# EAGLE schematic PCB 2.2.2 (EAGLE 6.5.0)
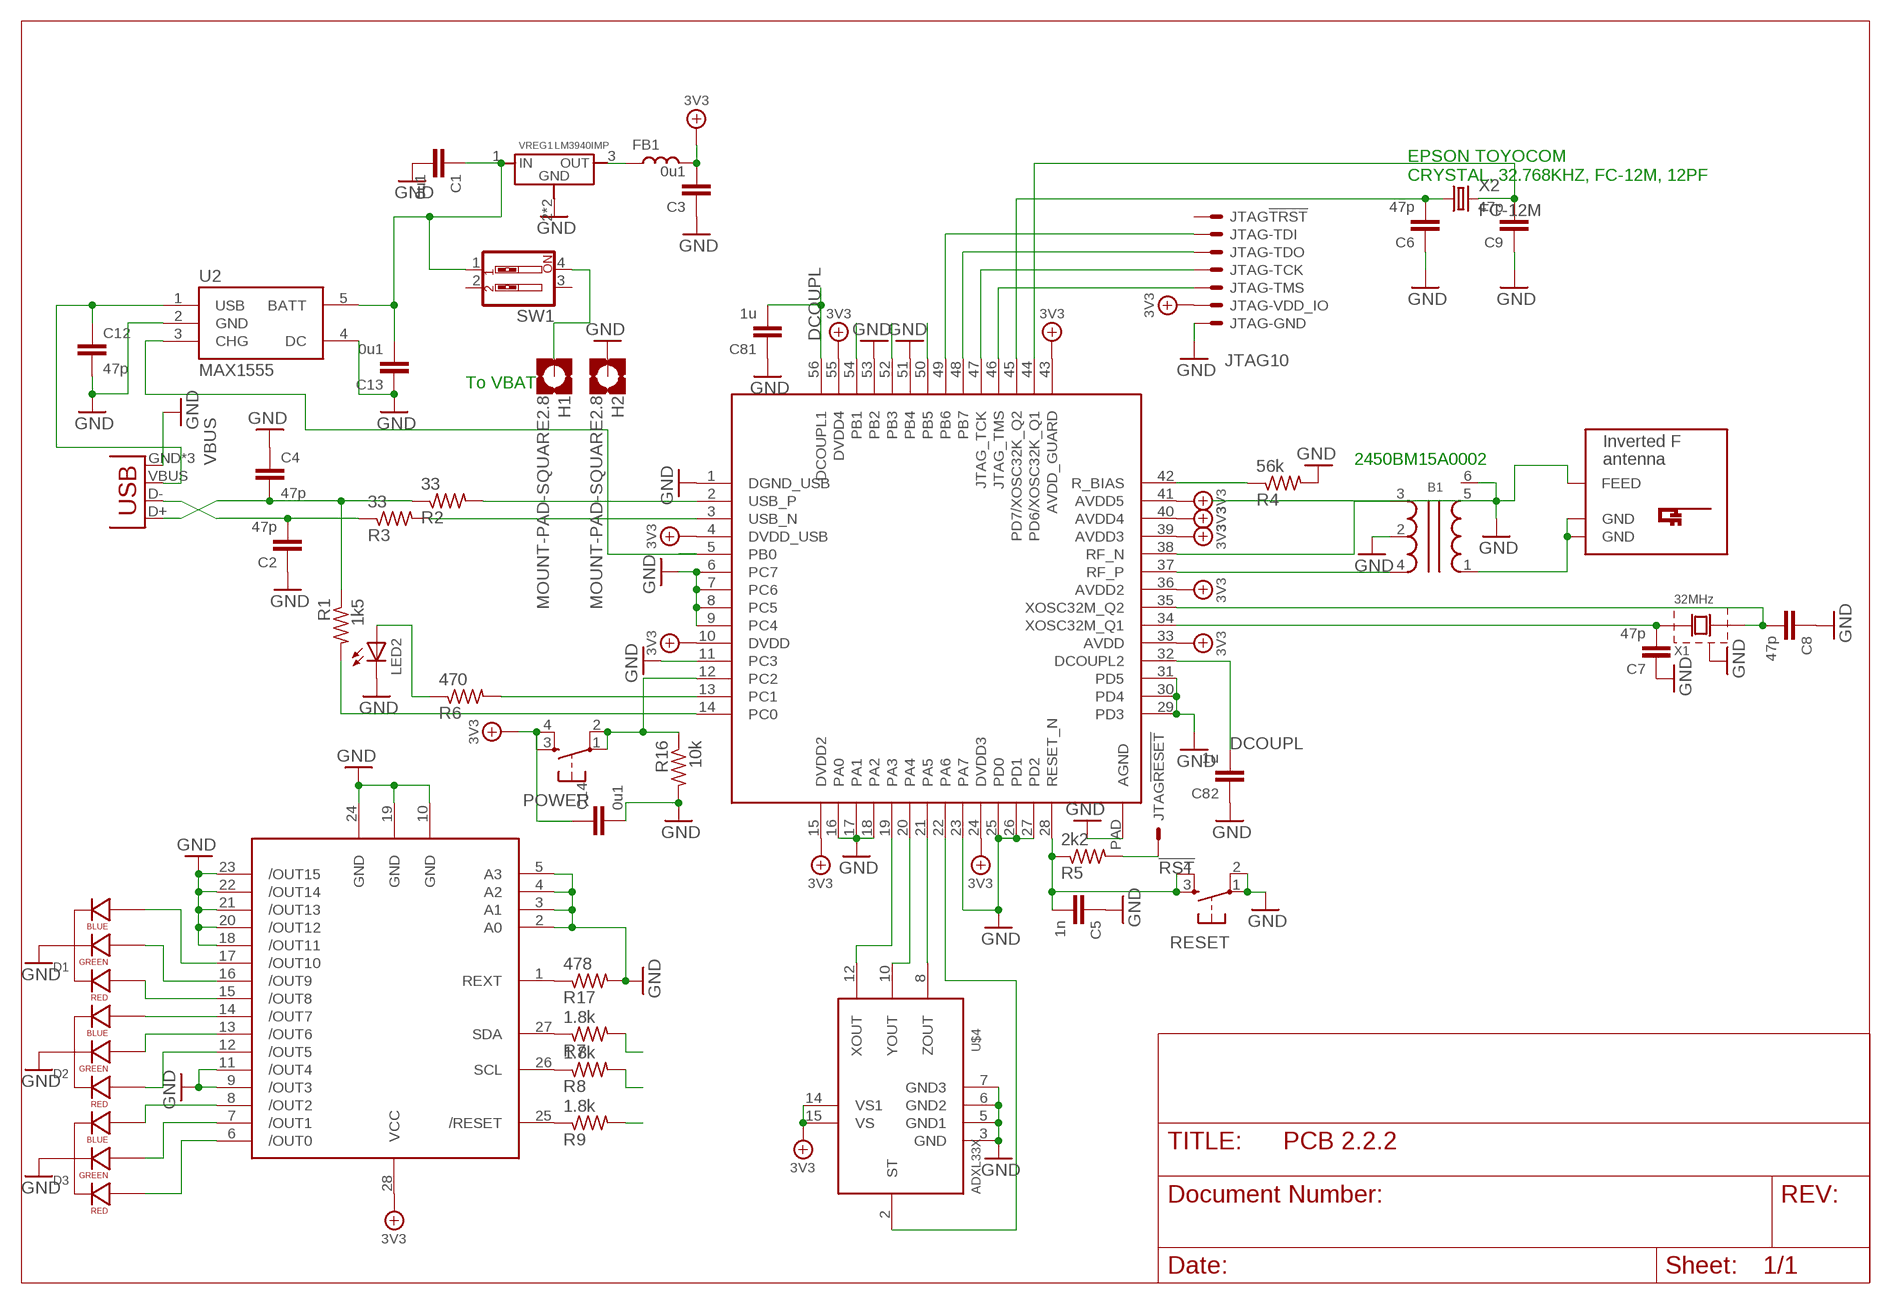
[diagram p0: schematic, sheet 1]

## Parts
B1  BALUN  [BALUN-0805]
C1  0u1  CC0402  [C0402]
C2  47p  CC0603  [C0603]
C3  0u1  CC0402  [C0402]
C4  47p  CC0603  [C0603]
C5  1n  CC0402  [C0402]
C6  47p  CC0603  [C0603]
C7  47p  CC0603  [C0603]
C8  47p  CC0603  [C0603]
C9  47p  CC0603  [C0603]
C12  47p  CC0603  [C0603]
C13  0u1  CC0402  [C0402]
C14  0u1  CC0402  [C0402]
C81  1u  CC0402  [C0402]
C82  1u  CC0402  [C0402]
D1  LED-RGB-CC-THRUDIFFUSE  [LED-RGB-THRU]
D2  LED-RGB-CC-THRUDIFFUSE  [LED-RGB-THRU]
D3  LED-RGB-CC-THRUDIFFUSE  [LED-RGB-THRU]
FB1  L0603  [R603]
H1  MOUNT-PAD-SQUARE2.8  [2,8-PAD-SQUARE]
H2  MOUNT-PAD-SQUARE2.8  [2,8-PAD-SQUARE]
JP1  USB-MICROB  [USB-MICROB]
JTAG  JTAG10  [HDR-2X5-2.00]
LED2  LED805  [LED-805]
POWER  TAC_SWITCHSMD  [TACTILE_SWITCH_SMD]
R1  1k5  R-US_R0402  [R0402]
R2  33  R-US_R0402  [R0402]
R3  33  R-US_R0402  [R0402]
R4  56k  R-US_R0402  [R0402]
R5  2k2  R-US_R0402  [R0402]
R6  470  R-US_R0402  [R0402]
R7  1.8k  R-US_R0402  [R0402]
R8  1.8k  R-US_R0402  [R0402]
R9  1.8k  R-US_R0402  [R0402]
R16  10k  R-US_R0402  [R0402]
R17  478  R-US_R0402  [R0402]
RESET  TAC_SWITCHSMD  [TACTILE_SWITCH_SMD]
SW1  SW_DIP-2  [DIPSWITCH-02]
U1  CC2538  [QFN56]
U2  MAX1555  [SOT23-5]
U$2  INVERTED_F_ANTENNA+0  [DN007+0]
U$3  TLC59116  [TSSOP28]
U$4  ADXL33X  [16LCSP]
VREG1  LM3940IMP  [SOT223]
X1  32MHz  XTAL-43225  [XTAL-4-3225]
X2  FC-12M  [FC-12M]

## Nets
3V3: C3.2 C14.1 FB1.2 JTAG.1 JTAG.2 POWER.3 POWER.4 U1.4(DVDD_USB) U1.10(DVDD) U1.15(DVDD2) U1.24(DVDD3) U1.33(AVDD) U1.36(AVDD2) U1.39(AVDD3) U1.40(AVDD4) U1.41(AVDD5) U1.43(AVDD_GUARD) U1.55(DVDD4) U$3.28(VCC) U$4.14(VS1) U$4.15(VS)
!RST: JTAG.4 R5.2
!RST_PIN: C5.2 R5.1 RESET.3 RESET.4 U1.28(RESET_N)
ACCRESET: R9.2 U1.54(PB1)
ACCSCL: R8.2 U1.52(PB3)
ACCSDA: R7.2 U1.50(PB5)
CN1: C4.2 JP1.D+ R1.1 R2.1
DCOUPL: C81.2 C82.2 U1.32(DCOUPL2) U1.56(DCOUPL1)
GND: B1.2 B1.5 B1.6 C1.2 C2.1 C3.1 C4.1 C5.1 C6.1 C7.1 C8.1 C9.1 C12.2 C13.1 C14.2 C81.1 C82.1 D1.2(CATHODE) D2.2(CATHODE) D3.2(CATHODE) H2.B2,8(MOUNT) JP1.GND JP1.MT1(GND) JP1.MT2(GND) JTAG.8 JTAG.10 LED2.C R4.2 R16.2 R17.2 RESET.1 RESET.2 U1.1(DGND_USB) U1.6(PC7) U1.7(PC6) U1.8(PC5) U1.9(PC4) U1.11(PC3) U1.16(PA0) U1.18(PA2) U1.23(PA7) U1.25(PD0) U1.26(PD1) U1.27(PD2) U1.29(PD3) U1.30(PD4) U1.31(PD5) U1.51(PB4) U1.53(PB2) U1.PAD(AGND) U2.2(GND) U2.4(DC) U$2.FEED U$3.2(A0) U$3.3(A1) U$3.4(A2) U$3.5(A3) U$3.9(/OUT3) U$3.10(GND) U$3.11(/OUT4) U$3.18(/OUT11) U$3.19(GND) U$3.20(/OUT12) U$3.21(/OUT13) U$3.22(/OUT14) U$3.23(/OUT15) U$3.24(GND) U$4.3(GND) U$4.5(GND1) U$4.6(GND2) U$4.7(GND3) VREG1.2(GND) VREG1.4(GND) X1.2(GND1) X1.4(GND1)
N$1: R2.2 U1.2(USB_P)
N$2: R3.2 U1.3(USB_N)
N$3: POWER.1 POWER.2 R16.1 U1.12(PC2)
N$4: R1.2 U1.14(PC0)
N$5: R4.1 U1.42(R_BIAS)
N$6: JTAG.9 U1.47(JTAG_TCK)
N$7: JTAG.7 U1.46(JTAG_TMS)
N$8: U1.21(PA5) U$4.8(ZOUT)
N$9: U1.20(PA4) U$4.10(YOUT)
N$10: U1.19(PA3) U$4.12(XOUT)
N$11: C1.1 C13.2 SW1.1 U2.5(BATT) VREG1.1(IN)
N$12: C2.2 JP1.D- R3.1
N$13: H1.B2,8(MOUNT) SW1.4
N$14: D3.1(RED_CATHODE) U$3.6(/OUT0)
N$15: D3.3(GREEN_CATHODE) U$3.7(/OUT1)
N$16: U1.22(PA6) U$4.2(ST)
N$17: FB1.1 VREG1.3(OUT)
N$18: D3.4(BLUE_CATHODE) U$3.8(/OUT2)
N$19: R17.1 U$3.1(REXT)
N$20: D1.1(RED_CATHODE) U$3.15(/OUT8)
N$21: U1.5(PB0) U2.3(CHG)
N$22: D1.3(GREEN_CATHODE) U$3.16(/OUT9)
N$23: C6.2 U1.45(PD7/XOSC32K_Q2) X2.1
N$24: D2.1(RED_CATHODE) U$3.12(/OUT5)
N$25: D1.4(BLUE_CATHODE) U$3.17(/OUT10)
N$26: D2.3(GREEN_CATHODE) U$3.13(/OUT6)
N$27: B1.3 U1.38(RF_N)
N$28: B1.4 U1.37(RF_P)
N$29: D2.4(BLUE_CATHODE) U$3.14(/OUT7)
N$30: C8.2 U1.35(XOSC32M_Q2) X1.3(X2)
N$31: C7.2 U1.34(XOSC32M_Q1) X1.1(X1)
N$40: C9.2 U1.44(PD6/XOSC32K_Q1) X2.2
N$42: LED2.A R6.1
N$43: R6.2 U1.13(PC1)
N$50: R7.1 U$3.27(SDA)
N$51: R8.1 U$3.26(SCL)
N$52: R9.1 U$3.25(/RESET)
PB6: JTAG.5 U1.49(PB6)
PB7: JTAG.6 U1.48(PB7)
RF: B1.1 U$2.GND U$2.GND@1(GND)
VBUS: C12.1 JP1.VBUS U2.1(USB)
Unconnected: JTAG.3 SW1.2 SW1.3 U1.17(PA1)

## Notes on the sheet
- EPSON TOYOCOM
  CRYSTAL, 32.768KHZ, FC-12M, 12PF
- To VBAT
- 2450BM15A0002

## Library data of the parts
B1 = discrete:BALUN
C1-C9 C12-C14 C81 C82 = discrete:C: CAPACITOR, European symbol
D1-D3 = SparkFun-LED2:LED-RGB-CC-THRU: RGB Through-hole common cathode LED SparkFun Storefront: COM-00105 (Clear) COM-09264 (Diffuse); PROD_ID: DIO-09434
FB1 = discrete:L
H1 H2 = holes:MOUNT-PAD-SQUARE: MOUNTING PAD, square
JP1 = SparkFun-Connectors:USB: USB Connectors USB-B-PTH is fully proven SKU : PRT-00139/CONN-08278 USB-miniB is fully proven SKU : PRT-00587 USB-A-PCB is untested. USB-A-H is throughly reviewed, but untested. Spark Fun Electronics SKU : PRT-00437 USB-B-SMT is throughly reviewed, but untested. Needs silkscreen touching up. USB-A-S has not been used/tested USB-MB-H has not been used/tested USB-MICROB has been used. CONN-09505; PROD_ID: CONN-09505
JTAG = jtag:JTAG10
LED2 = discrete:LED
POWER RESET = SparkFun-Electromechanical:TAC_SWITCH: Momentary Switch Button commonly used for reset or general input. Spark Fun Electronics SKU : COM-00097 SMT- SWCH-08247; PROD_ID: SWCH-08247
R1-R9 R16 R17 = rcl:R-US_: RESISTOR, American symbol
SW1 = SparkFun-Electromechanical:SW_DIP-2: DIP SWITCH
U1 = ic:CC2538
U2 = SparkFun-PowerIC:MAX1555: MAX1555 Lithium Charger IC SOT-23 Lithium Polymer charging IC. Schematic element and footprint proven. Spark Fun Electronics SKU : COM-00674
U$2 = antenna:INVERTED_F_ANTENNA: 2.4GHz Inverted F Antenna Based on TI Design Note DN007
U$3 = tlc59116:TLC59116
U$4 = adafruit:ADXL33X
VREG1 = voltage-regulators:LM3940
X1 = discrete:XTAL-4
X2 = crystal:FC-12M: kHz RANGE CRYSTAL UNIT LOW PROFILE SMD Source: Epson Toyocom FC-12M.pdf

## Net classes
0 default: width 0.152 mm, drill 0.305 mm, clearance 0.152 mm
1 RF: width 0.152 mm, clearance 0.152 mm